# Altium schematic sheet Sheet1.SchDoc
size A; SheetNumber: 1; SheetTotal: 2
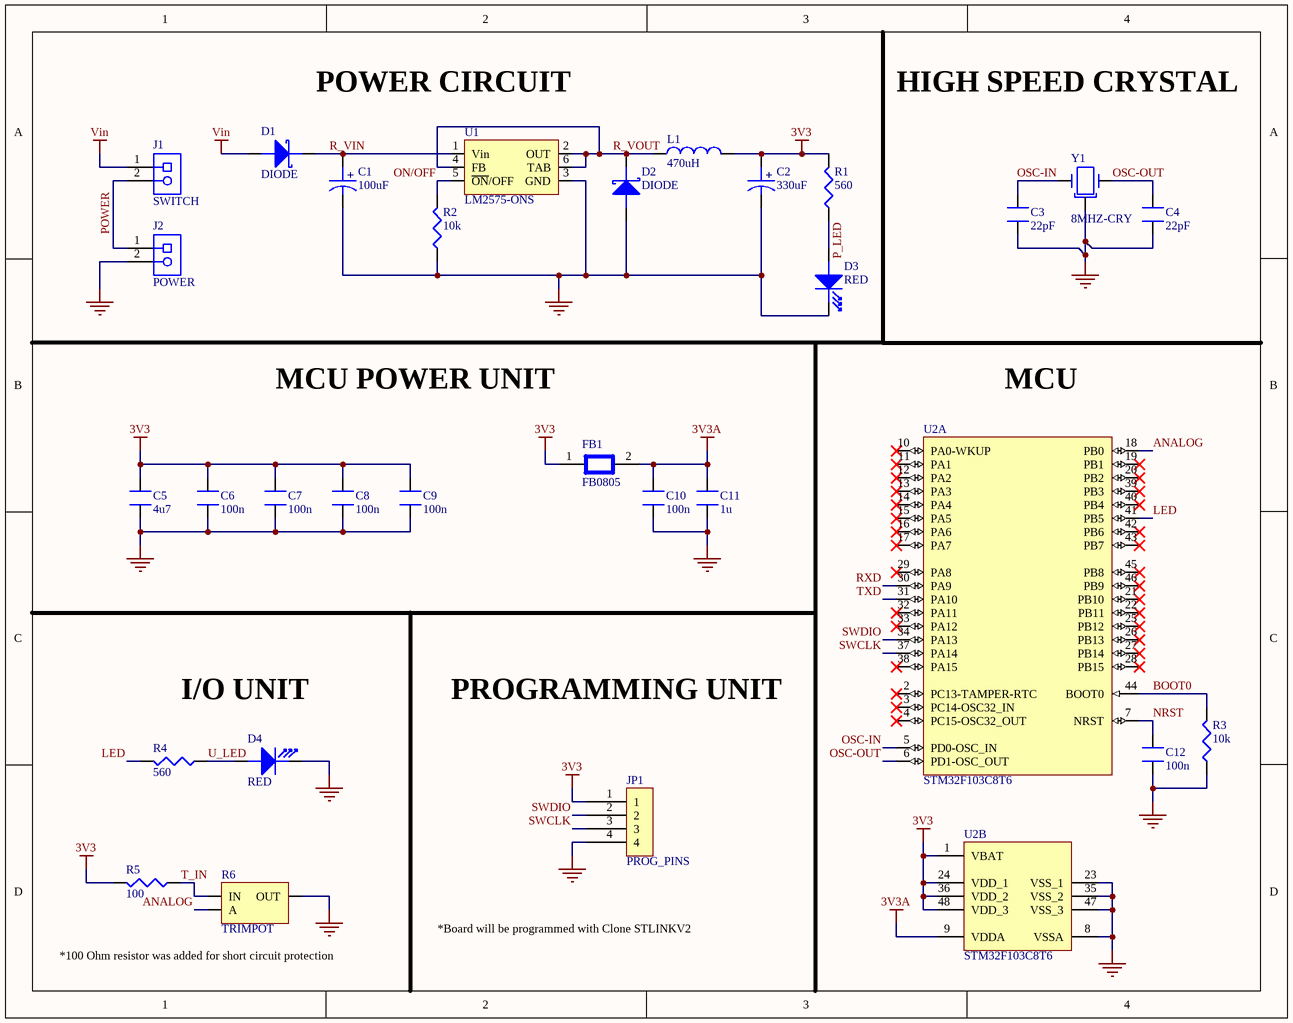
[diagram p0: Sheet1.SchDoc]

## Parts
C1  100uF  [10X10-ALCAP]
C2  330uF  [10X10-ALCAP]
C3  22pF  [Z0603]
C4  22pF  [Z0603]
C5  4u7  [Z0603]
C6  100n  [Z0603]
C7  100n  [Z0603]
C8  100n  [Z0603]
C9  100n  [Z0603]
C10  100n  [Z0603]
C11  1u  [Z0603]
C12  100n  [Z0603]
D1  DIODE  [SOD-123]
D2  DIODE  [SOD-123]
D3  RED  [LED-0603]
D4  RED  [LED-0603]
FB1  FB0805  [C0805]
J1  SWITCH  [PHOE-1729128-2_V]
J2  POWER  [PHOE-1729128-2_V]
JP1  PROG_PINS  [HDR-1X4-2.54mm]
L1  470uH  [10X9-IND]
R1  560  [R0603]
R2  10k  [R0603]
R3  10k  [R0603]
R4  560  [R0603]
R5  100  [R0603]
R6  TRIMPOT  [TRIM-3]
U1  LM2575-ONS  [D2PAK]
U2  STM32F103C8T6  [STM-LQFP48_L]  (parts A,B of 2)
Y1  8MHZ-CRY  [4-SMD]

## Nets
3V3: C2.1 C5.2 C6.2 C7.2 C8.2 C9.2 FB1.1 JP1.1 L1.2 R1.2 R5.2 U2.1(VBAT) U2.24(VDD_1) U2.36(VDD_2) U2.48(VDD_3)
3V3A: C10.2 C11.2 FB1.2 U2.9(VDDA)
GND: C1.2 C2.2 C3.1 C4.1 C5.1 C6.1 C7.1 C8.1 C9.1 C10.1 C11.1 C12.1 D2.2(Anode) D3.1(Cathode) D4.1(Cathode) J2.2 JP1.4 R2.1 R3.1 R6.3(OUT) U1.3(GND) U2.8(VSSA) U2.23(VSS_1) U2.35(VSS_2) U2.47(VSS_3) Y1.2
Vin: D1.2(Anode) J1.1
ANALOG: R6.2(A) U2.18(PB0)
BOOT0: R3.2 U2.44(BOOT0)
LED: R4.2 U2.41(PB5)
NRST: C12.2 U2.7(NRST)
ON/OFF: R2.2 U1.5(~{ON}/OFF)
OSC-IN: C3.2 U2.5(PD0-OSC_IN) Y1.1
OSC-OUT: C4.2 U2.6(PD1-OSC_OUT) Y1.3
P_LED: D3.2(Anode) R1.1
POWER: J1.2 J2.1
R_VIN: C1.1 D1.1(Cathode) U1.1(Vin)
R_VOUT: D2.1(Cathode) L1.1 U1.2(OUT) U1.4(FB) U1.6(TAB)
RXD: U2.30(PA9)
SWCLK: JP1.3 U2.37(PA14)
SWDIO: JP1.2 U2.34(PA13)
T_IN: R5.1 R6.1(IN)
TXD: U2.31(PA10)
U_LED: D4.2(Anode) R4.1

Not connected (* = marked no-connect by the designer): U2 2(PC13-TAMPER-RTC)* 3(PC14-OSC32_IN)* 4(PC15-OSC32_OUT)* 10(PA0-WKUP)* 11(PA1)* 12(PA2)* 13(PA3)* 14(PA4)* 15(PA5)* 16(PA6)* 17(PA7)* 19(PB1)* 20(PB2)* 21(PB10)* 22(PB11)* 25(PB12)* 26(PB13)* 27(PB14)* 28(PB15)* 29(PA8)* 32(PA11)* 33(PA12)* 38(PA15)* 39(PB3)* 40(PB4)* 42(PB6)* 43(PB7)* 45(PB8)* 46(PB9)*

## Notes on the sheet
- POWER CIRCUIT
- HIGH SPEED CRYSTAL
- MCU POWER UNIT
- MCU
- I/O UNIT
- PROGRAMMING UNIT
- (near R6) *100 Ohm resistor was added for short circuit protection
- *Board will be programmed with Clone STLINKV2
- (in symbol 10X10-ALCAP) +

## Library data of the parts
C1 = 10X10-ALCAP: Manufacturer Product Number: CK1H107M10010VR; Unit_Price: 3,73; Order Link: https://ozdisan.com/pasif-komponentler/kondansatorler/aluminyum-kondansatorler/CK1H107M10010VR
C2 = 10X10-ALCAP: Manufacturer Product Number: BDS35VC330MJ10TP; Unit_Price: 4,58; Order Link: https://ozdisan.com/pasif-komponentler/kondansatorler/aluminyum-kondansatorler/BDS35VC330MJ10TP
C3 C4 = C0603: Manufacturer Product Number: CL10C220JB8NNNC; Unit_Price: 0,14; Case/Package: 0603; Order Link: https://ozdisan.com/pasif-komponentler/kondansatorler/smt-smd-ve-mlcc-kondansatorler/CL10C220JB8NNNC
C5 = C0603: Manufacturer Product Number: CL10A475KP8NNNC; Unit_Price: 0,20; Case/Package: 0603; Order Link: https://ozdisan.com/pasif-komponentler/kondansatorler/smt-smd-ve-mlcc-kondansatorler/CL10A475KP8NNNC
C6-C10 C12 = C0603: Manufacturer Product Number: C0603C104J5RAC7867; Unit_Price: 0,38; Case/Package: 0603; Order Link: https://ozdisan.com/pasif-komponentler/kondansatorler/smt-smd-ve-mlcc-kondansatorler/C0603C104J5RAC7867
C11 = C0603: Manufacturer Product Number: CL10B105KA8NNNC; Unit_Price: 0,14; Case/Package: 0603; Order Link: https://ozdisan.com/pasif-komponentler/kondansatorler/smt-smd-ve-mlcc-kondansatorler/CL10B105KA8NNNC
D1 D2 = D-SOD123: Manufacturer Product Number: BYS10-45-E3/TR3; Unit_Price: 4,25; Case/Package: SOD123; Order Link: https://ozdisan.com/guc-yari-iletkenleri/diyotlar-modul-diyotlar-ve-dogrultucular/schottky-diyotlar/BYS10-45-E3TR3
D3 D4 = L0603: Manufacturer Product Number: HL-PST-1608S9AC; Unit_Price: 0,33; Case/Package: 0603; Order Link: https://ozdisan.com/led-ve-aydinlatma-cozumleri/led-komponentler/sinyal-ledler-renkli/HL-PST-1608S9AC
FB1 = FB0805: Manufacturer Product Number: LCB2012-101Y-N; Unit_Price: 0,31; Case/Package: 0805; Order Link: https://ozdisan.com/pasif-komponentler/induktorler/bead-feritler/LCB2012-101Y-N
J1 J2 = CMP-2000-05815-1: PCB Terminal Block, 13.5 A, 400 V, 2-Pin THD, RoHS, Bulk; Manufacturer Product Number: DG129-5.08-02P-14-00SH; Pitch: 5.08mm; Unit_Price: 4,49; Case/Package: 2P; Order Link: https://ozdisan.com/konnektor-ve-baglanti-elemanlari/klemensler/pcb-klemensler/DG129-5-08-02P-14-00SH
JP1 = 1X4MALE: Unit_Price: *; Manufacturer Product Number: *; Order Link: *
L1 = 10X9-IND: Manufacturer Product Number: FPI1005-471K; Unit_Price: 3,99; Order Link: https://ozdisan.com/pasif-komponentler/induktorler/sabit-induktorler/FPI1005-471K
R1 R4 = R0603: Manufacturer Product Number: 0603SAJ0561T5E; Order Link: https://ozdisan.com/pasif-komponentler/direncler/smt-smd-ve-cip-direncler/0603SAJ0561T5E; Unit Price: 0,03; Case/Package: 0603
R2 R3 = R0603: Manufacturer Product Number: CQ03SAF1002T5E; Order Link: https://ozdisan.com/pasif-komponentler/direncler/smt-smd-ve-cip-direncler/CQ03SAF1002T5E; Unit Price: 0,06; Case/Package: 0603
R5 = R0603: Manufacturer Product Number: 0603SAJ0101T5E; Order Link: https://ozdisan.com/pasif-komponentler/direncler/smt-smd-ve-cip-direncler/0603SAJ0101T5E; Unit Price: 0,03; Case/Package: 0603
U1 = LM2575: Manufacturer Product Number: LM2575D2T-3.3R4G; Unit_Price: 41,51; Case/Package: D2PAK; Order Link: https://ozdisan.com/entegre-devreler-ics/guc-entegreleri/dc-dc-voltaj-regulatorleri/LM2575D2T-3-3R4G
U2 = CMP-0237-00215-3: ARM Cortex-M3 32-bit MCU, 64 KB Flash, 20 KB Internal RAM, 37 I/Os, 48-pin LQFP, -40 to 85 degC, Tray; Supply Voltage(Vcc) min (V): 2; Internal RAM Size (kB): 20; FLASH Size (Prog) (kB): 64; A/D Converter: 2x12-bit (10 Channel); I/Os (High Current): 37; Operating Frequency(F) (Processor speed) (MHz): 72; Core: ARM Cortex-M3; ComponentLink3Description: Package Specification; Mounting Technology: Surface Mount; PartNumber: STM32F103C8T6; PackageReference: LQFP48; Packing: Tray; ComponentLink3URL: http://www.st.com/st-web-ui/static/active/en/resource/technical/document/datasheet/DM00058181.pdf; DatasheetVersion: Rev. 16; ComponentLink1URL: http://www.st.com/web/en/home.html; PackageVersion: Rev. 6, 06/2013; ComponentLink2URL: http://www.st.com/st-web-ui/static/active/en/resource/technical/document/datasheet/CD00161566.pdf; ComponentLink1Description: Manufacturer URL; ComponentLink2Description: Datasheet; PackageDescription: 48-Pin Low Profile Quad Flat Package, 7 x 7 mm Body, 0.5 mm Pitch
Y1 = 8MHZ-CRYS-4S: pin to pad: 2>2+4; Manufacturer Product Number: H130B-8.000-18-3030-EXT-; Unit_Price: 7,78; Case/Package: 4-SMD; Order Link: https://ozdisan.com/pasif-komponentler/kristaller-osilatorler-ve-rezanatorler/kristaller/H130B-8-000-18-3030-EXT-
R6 = TRIMPOT: Manufacturer Product Number: *; Order Link: *; Unit_Price: *; Case/Package: *